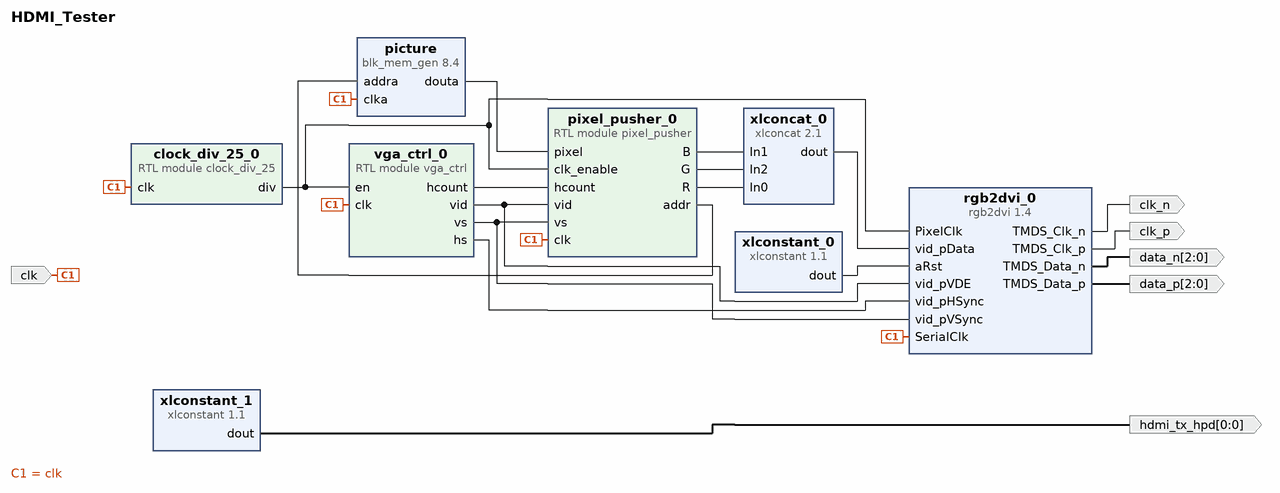
[diagram p0: block diagram of the top level]
# Vivado block design HDMI_Tester, xc7z010iclg225-1L, Vivado 2021.1
create_bd_design HDMI_Tester

create_bd_port -dir I -type clk clk
create_bd_port -dir O -from 0 -to 0 hdmi_tx_hpd
create_bd_port -dir O -type clk clk_p
create_bd_port -dir O -type clk clk_n
create_bd_port -dir O -from 2 -to 0 data_p
create_bd_port -dir O -from 2 -to 0 data_n

create_bd_cell -type module -reference clock_div_25 clock_div_25_0
create_bd_cell -type module -reference pixel_pusher pixel_pusher_0
create_bd_cell -type module -reference vga_ctrl vga_ctrl_0
create_bd_cell -type ip -vlnv xilinx.com:ip:xlconstant:1.1 xlconstant_0
set_property -dict {CONFIG.CONST_VAL 0} [get_bd_cells xlconstant_0]
create_bd_cell -type ip -vlnv xilinx.com:ip:xlconcat:2.1 xlconcat_0
set_property -dict {CONFIG.IN0_WIDTH 8 CONFIG.IN1_WIDTH 8 CONFIG.IN2_WIDTH 8 CONFIG.NUM_PORTS 3} [get_bd_cells xlconcat_0]
create_bd_cell -type ip -vlnv xilinx.com:ip:blk_mem_gen:8.4 picture
set_property -dict [list \
  CONFIG.Coe_File ../../../../../../pic.coe \
  CONFIG.Enable_32bit_Address false \
  CONFIG.Enable_A Always_Enabled \
  CONFIG.Load_Init_File true \
  CONFIG.Memory_Type Single_Port_ROM \
  CONFIG.Port_A_Write_Rate 0 \
  CONFIG.Register_PortA_Output_of_Memory_Primitives false \
  CONFIG.Use_RSTA_Pin false \
  CONFIG.Write_Depth_A 4096 \
  CONFIG.Write_Width_A 16 \
  CONFIG.use_bram_block Stand_Alone \
] [get_bd_cells picture]
create_bd_cell -type ip -vlnv xilinx.com:ip:xlconstant:1.1 xlconstant_1
create_bd_cell -type ip -vlnv digilentinc.com:ip:rgb2dvi:1.4 rgb2dvi_0
set_property -dict {CONFIG.kGenerateSerialClk false CONFIG.kRstActiveHigh true} [get_bd_cells rgb2dvi_0]

# ---- connections ----

connect_bd_net -net blk_mem_gen_0_douta [get_bd_pins picture/douta] [get_bd_pins pixel_pusher_0/pixel]
connect_bd_net -net clk_0_1 [get_bd_ports clk] \
  [get_bd_pins clock_div_25_0/clk] [get_bd_pins vga_ctrl_0/clk] [get_bd_pins pixel_pusher_0/clk] [get_bd_pins picture/clka] \
  [get_bd_pins rgb2dvi_0/SerialClk]
connect_bd_net [get_bd_pins clock_div_25_0/div] [get_bd_pins vga_ctrl_0/en] [get_bd_pins pixel_pusher_0/clk_enable] [get_bd_pins rgb2dvi_0/PixelClk]
connect_bd_net [get_bd_pins pixel_pusher_0/B] [get_bd_pins xlconcat_0/In1]
connect_bd_net [get_bd_pins pixel_pusher_0/G] [get_bd_pins xlconcat_0/In2]
connect_bd_net [get_bd_pins pixel_pusher_0/R] [get_bd_pins xlconcat_0/In0]
connect_bd_net [get_bd_pins pixel_pusher_0/addr] [get_bd_pins picture/addra]
connect_bd_net [get_bd_pins rgb2dvi_0/TMDS_Clk_n] [get_bd_ports clk_n]
connect_bd_net [get_bd_pins rgb2dvi_0/TMDS_Clk_p] [get_bd_ports clk_p]
connect_bd_net [get_bd_pins rgb2dvi_0/TMDS_Data_n] [get_bd_ports data_n]
connect_bd_net [get_bd_pins rgb2dvi_0/TMDS_Data_p] [get_bd_ports data_p]
connect_bd_net [get_bd_pins vga_ctrl_0/hcount] [get_bd_pins pixel_pusher_0/hcount]
connect_bd_net [get_bd_pins vga_ctrl_0/hs] [get_bd_pins rgb2dvi_0/vid_pHSync]
connect_bd_net [get_bd_pins vga_ctrl_0/vid] [get_bd_pins rgb2dvi_0/vid_pVDE] [get_bd_pins pixel_pusher_0/vid]
connect_bd_net [get_bd_pins vga_ctrl_0/vs] [get_bd_pins pixel_pusher_0/vs] [get_bd_pins rgb2dvi_0/vid_pVSync]
connect_bd_net [get_bd_pins xlconcat_0/dout] [get_bd_pins rgb2dvi_0/vid_pData]
connect_bd_net [get_bd_pins xlconstant_0/dout] [get_bd_pins rgb2dvi_0/aRst]
connect_bd_net [get_bd_pins xlconstant_1/dout] [get_bd_ports hdmi_tx_hpd]

validate_bd_design
save_bd_design
